# Altium schematic sheet controller module.SchDoc: EE 453 Capstone
size C; ApprovedBy: Your Name; CheckedBy: Your Name; Author: Your Name; CompanyName: Dept. of Elec. and Comp. Engg.; DrawnBy: Your Name; Engineer: Your Nmae; Organization: UW-Seattle; Address1: 185 Stevens Way; Address2: Paul Allen Center; Address3: Seattle, WA; Address4: US-98195; DocumentNumber: 1; Revision: 1.0; SheetNumber: 1; SheetTotal: 1
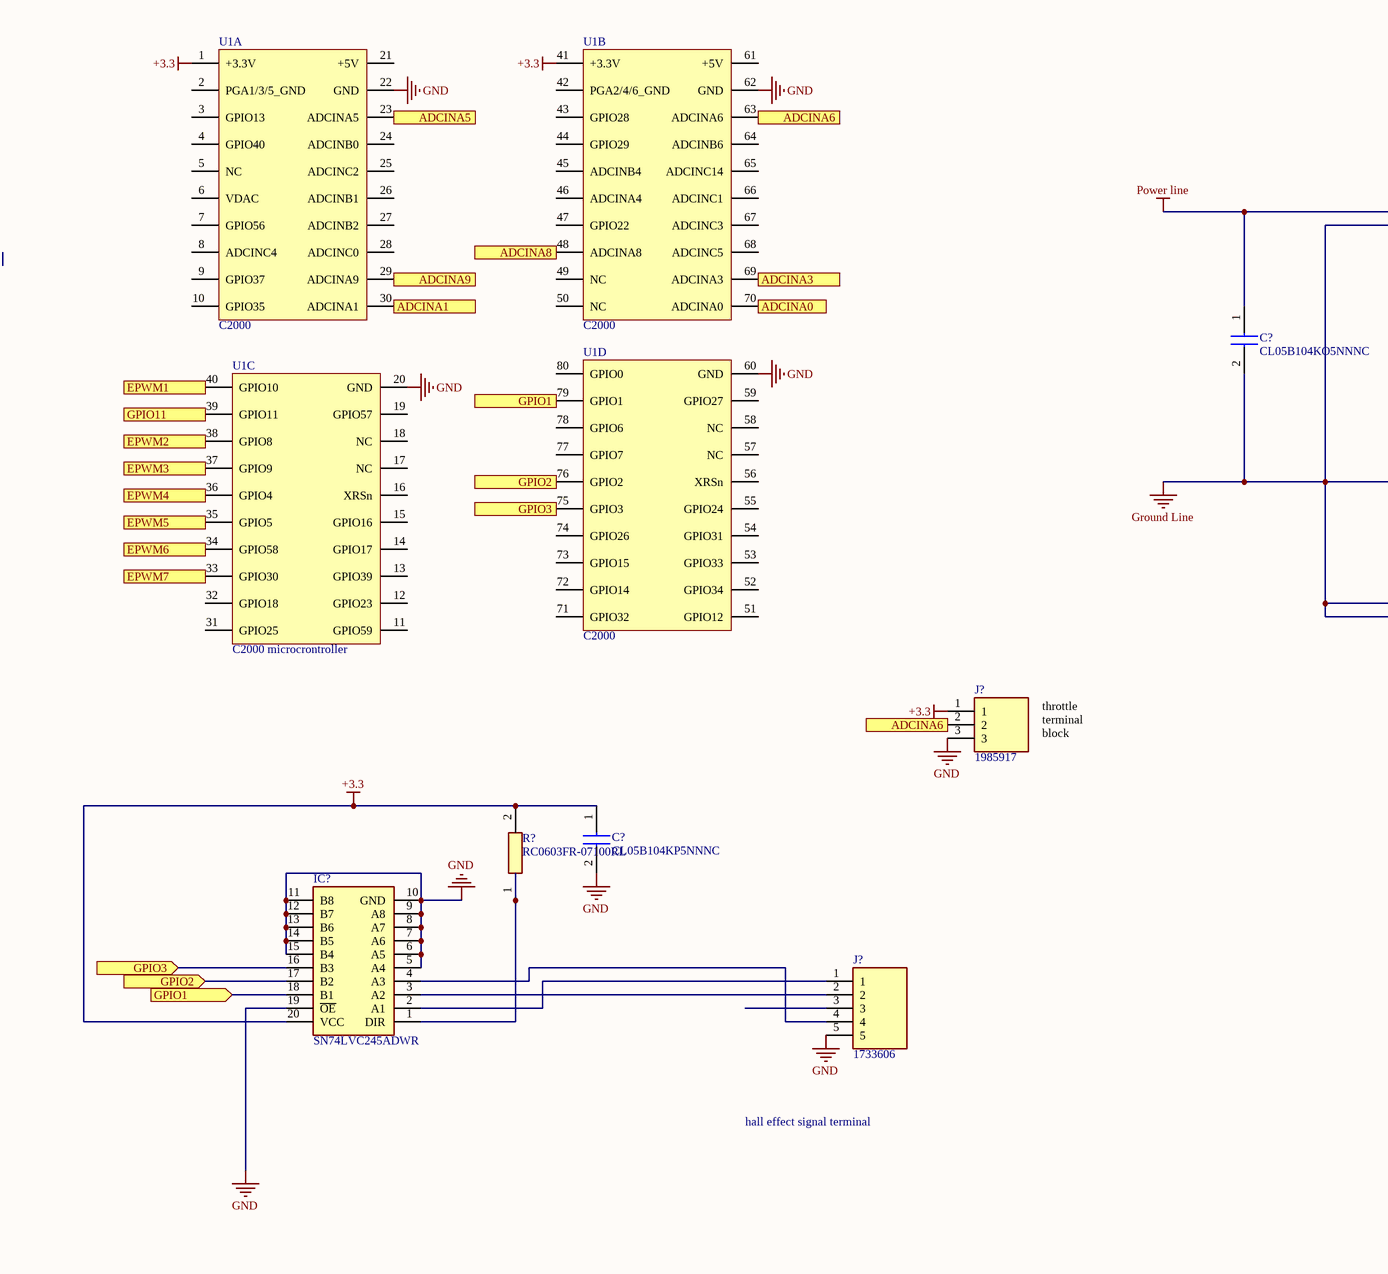
[diagram p0: controller module.SchDoc, left]
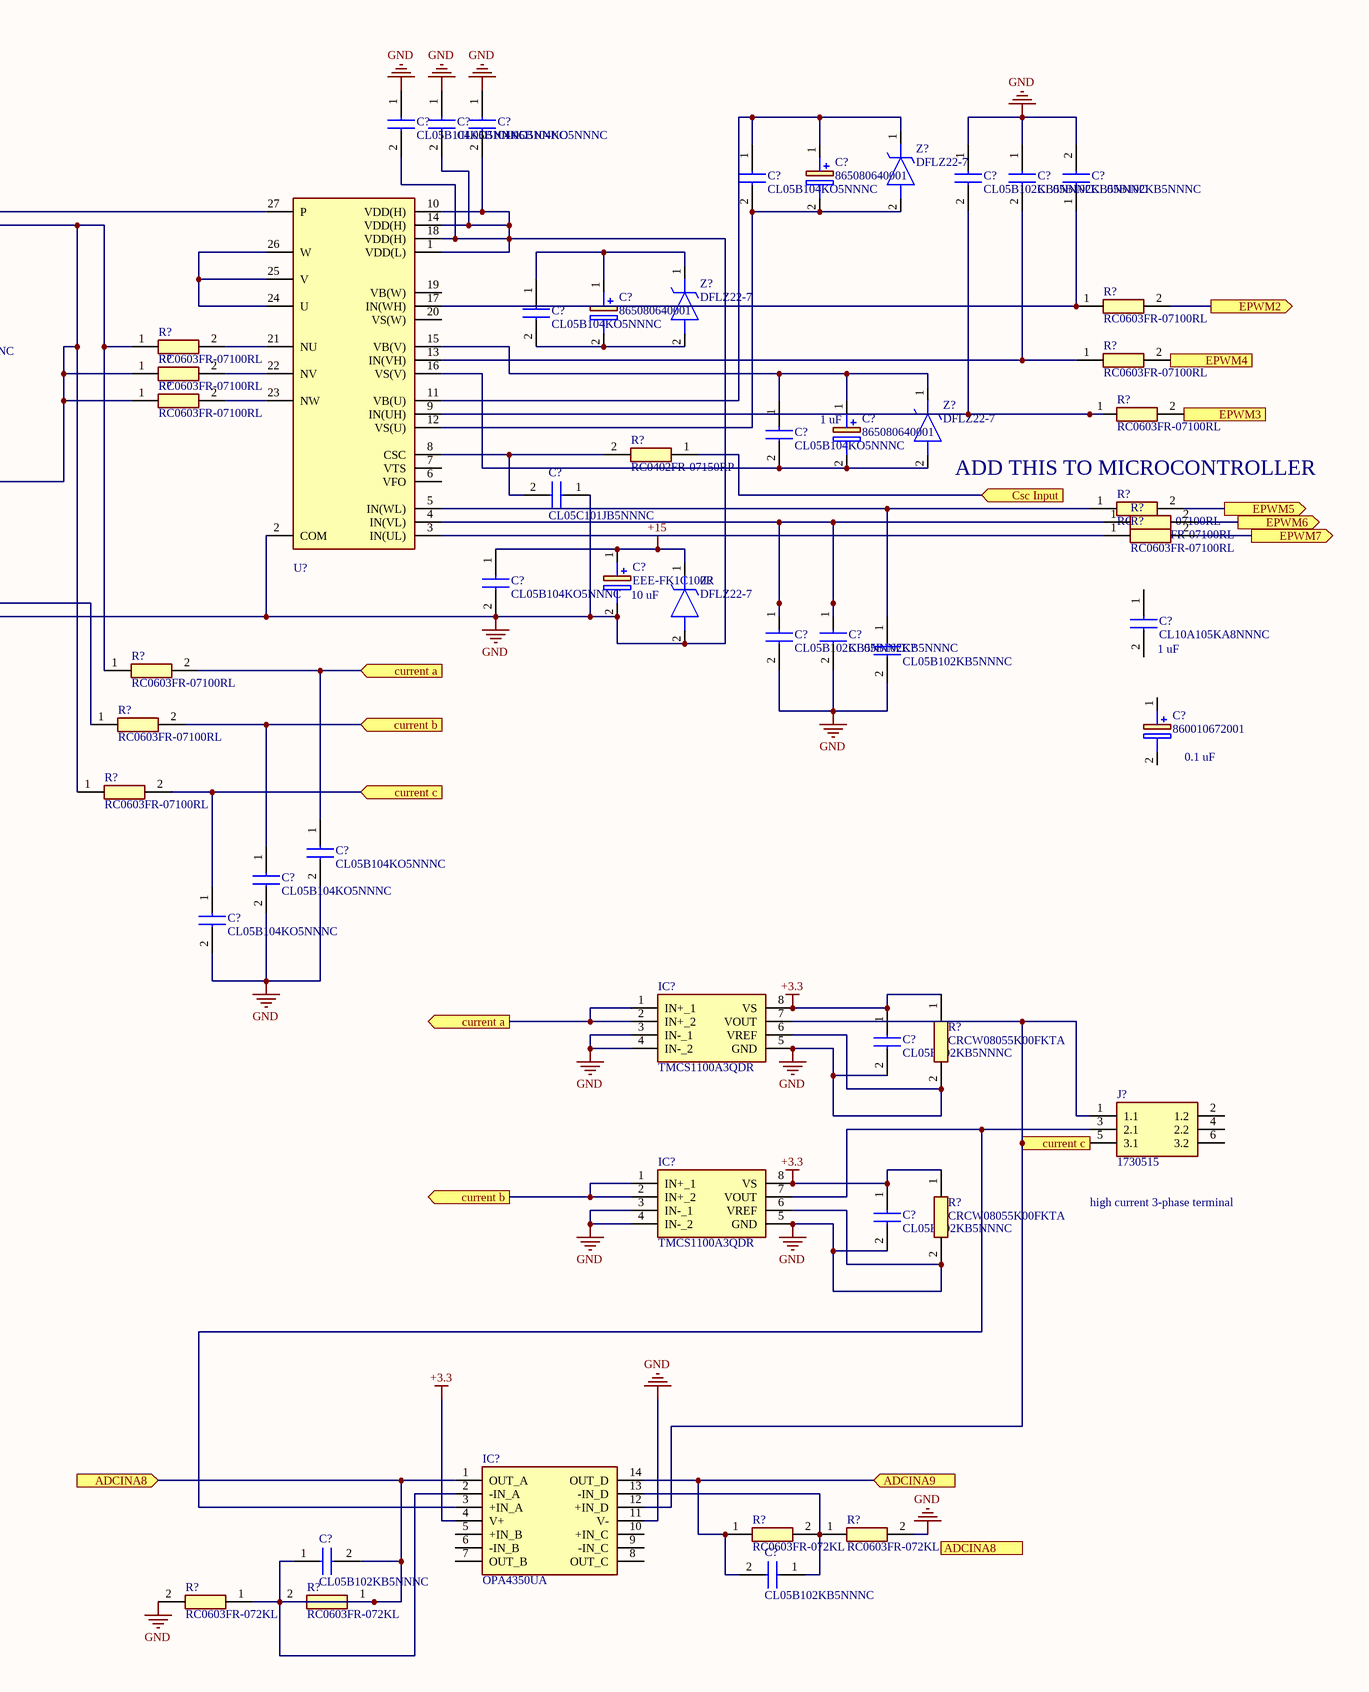
[diagram p1: controller module.SchDoc, right]

## Parts
(Parts that share a designator on the sheet are numbered #1, #2 ... from top to bottom, then left to right.)
C?#1  CL05B104KO5NNNC  [CAPC1005X55N]
C?#2  CL05B104KO5NNNC  [CAPC1005X55N]
C?#3  CL05B104KO5NNNC  [CAPC1005X55N]
C?#4  CL05B104KO5NNNC  [CAPC1005X55N]
C?#5  865080640001  [CAPAE430X550N]
C?#6  CL05B102KB5NNNC  [CAPC1005X55N]
C?#7  CL05B102KB5NNNC  [CAPC1005X55N]
C?#8  CL05B102KB5NNNC  [CAPC1005X55N]
C?#9  CL05B104KO5NNNC  [CAPC1005X55N]
C?#10  865080640001  [CAPAE430X550N]
C?#11  CL05B104KO5NNNC  [CAPC1005X55N]
C?#12  CL05B104KO5NNNC  [CAPC1005X55N]
C?#13  865080640001  [CAPAE430X550N]
C?#14  CL05C101JB5NNNC  [CAPC1005X55N]
C?#15  CL05B104KO5NNNC  [CAPC1005X55N]
C?#16  EEE-FK1C100R  [EEE1AA220WR]
C?#17  CL10A105KA8NNNC  [CAPC1608X90N]
C?#18  CL05B102KB5NNNC  [CAPC1005X55N]
C?#19  CL05B102KB5NNNC  [CAPC1005X55N]
C?#20  CL05B102KB5NNNC  [CAPC1005X55N]
C?#21  860010672001  [CAPPRD200W52D500H1250]
C?#22  CL05B104KP5NNNC  [CAPC1005X55N]
C?#23  CL05B104KO5NNNC  [CAPC1005X55N]
C?#24  CL05B104KO5NNNC  [CAPC1005X55N]
C?#25  CL05B104KO5NNNC  [CAPC1005X55N]
C?#26  CL05B102KB5NNNC  [CAPC1005X55N]
C?#27  CL05B102KB5NNNC  [CAPC1005X55N]
C?#28  CL05B102KB5NNNC  [CAPC1005X55N]
C?#29  CL05B102KB5NNNC  [CAPC1005X55N]
IC?#1  TMCS1100A3QDR  [SOIC127P600X175-8N]
IC?#2  SN74LVC245ADWR  [SOIC127P1030X265-20N]
IC?#3  TMCS1100A3QDR  [SOIC127P600X175-8N]
IC?#4  OPA4350UA  [SOIC127P600X175-14N]
J?#1  1985917  [1985917]
J?#2  1733606  [1733606]
J?#3  1730515  [1730515]
R?#1  RC0603FR-07100RL  [RESC1608X55N]
R?#2  RC0603FR-07100RL  [RESC1608X55N]
R?#3  RC0603FR-07100RL  [RESC1608X55N]
R?#4  RC0603FR-07100RL  [RESC1608X55N]
R?#5  RC0603FR-07100RL  [RESC1608X55N]
R?#6  RC0603FR-07100RL  [RESC1608X55N]
R?#7  RC0402FR-07150RP  [RESC1005X40N]
R?#8  RC0603FR-07100RL  [RESC1608X55N]
R?#9  RC0603FR-07100RL  [RESC1608X55N]
R?#10  RC0603FR-07100RL  [RESC1608X55N]
R?#11  RC0603FR-07100RL  [RESC1608X55N]
R?#12  RC0603FR-07100RL  [RESC1608X55N]
R?#13  RC0603FR-07100RL  [RESC1608X55N]
R?#14  RC0603FR-07100RL  [RESC1608X55N]
R?#15  CRCW08055K00FKTA  [RESC2012X50N]
R?#16  CRCW08055K00FKTA  [RESC2012X50N]
R?#17  RC0603FR-072KL  [RESC1608X55N]
R?#18  RC0603FR-072KL  [RESC1608X55N]
R?#19  RC0603FR-072KL  [RESC1608X55N]
R?#20  RC0603FR-072KL  [RESC1608X55N]
U1  C2000  [C2000]  (parts A,B,C,D of 4)
U?  FNB34060T  [FNB34060T]  (value not drawn)
Z?#1  DFLZ22-7  [POWERDI123_1]
Z?#2  DFLZ22-7  [POWERDI123_1]
Z?#3  DFLZ22-7  [POWERDI123_1]
Z?#4  DFLZ22-7  [POWERDI123_1]

## Ports
ADCINA0 (out), ADCINA1 (out), ADCINA3 (out), ADCINA5 (out), ADCINA6 (out), ADCINA8 (in), ADCINA8 (out), ADCINA9 (in), ADCINA9 (out), Csc Input (in), current a (in), current a (out), current b (in), current b (out), current c (in), current c (out), EPWM1 (in), EPWM2 (in), EPWM2 (out), EPWM3 (in), EPWM3 (out), EPWM4 (in), EPWM4 (out), EPWM5 (in), EPWM5 (out), EPWM6 (in), EPWM6 (out), EPWM7 (in), EPWM7 (out), GPIO1 (in), GPIO1 (out), GPIO2 (in), GPIO2 (out), GPIO3 (in), GPIO3 (out), GPIO11 (in)

## Nets
+3.3: C?#22.1 C?#26.1 C?#27.1 IC?#1.8(VS) IC?#2.20(VCC) IC?#3.8(VS) IC?#4.4(V+) J?#1.1 R?#14.2 R?#15.1 R?#16.1 U1.1(+3.3V) U1.41(+3.3V)
+15: C?#15.1 C?#16.1(+) Z?#4.1(K)
GND: C?#1.1 C?#1.2 C?#2.1 C?#2.2 C?#3.1 C?#3.2 C?#6.1 C?#7.1 C?#8.2 C?#11.2 C?#14.1 C?#15.2 C?#16.2(-) C?#18.2 C?#19.2 C?#20.2 C?#22.2 C?#23.2 C?#24.2 C?#25.2 C?#26.2 C?#27.2 IC?#1.3(IN-_1) IC?#1.4(IN-_2) IC?#1.5(GND) IC?#1.6(VREF) IC?#2.5(A4) IC?#2.6(A5) IC?#2.7(A6) IC?#2.8(A7) IC?#2.9(A8) IC?#2.10(GND) IC?#2.11(B8) IC?#2.12(B7) IC?#2.13(B6) IC?#2.14(B5) IC?#2.15(B4) IC?#2.19(~{OE}) IC?#3.3(IN-_1) IC?#3.4(IN-_2) IC?#3.5(GND) IC?#3.6(VREF) IC?#4.11(V-) J?#1.3 J?#2.5 R?#2.1 R?#4.1 R?#5.1 R?#11.1 R?#12.1 R?#13.1 R?#15.2 R?#16.2 R?#18.2 R?#19.2 U1.20(GND) U1.22(GND) U1.60(GND) U1.62(GND) U?.1(VDD(L)) U?.2(COM) U?.10(VDD(H)) U?.14(VDD(H)) U?.18(VDD(H)) Z?#4.2(A)  [also labelled Ground Line]
Power line: C?#11.1 U?.27(P)
ADCINA0: U1.70(ADCINA0) ; port ADCINA0
ADCINA1: U1.30(ADCINA1) ; port ADCINA1
ADCINA3: U1.69(ADCINA3) ; port ADCINA3
ADCINA5: U1.23(ADCINA5) ; port ADCINA5
ADCINA6: J?#1.2 U1.63(ADCINA6) ; port ADCINA6
ADCINA8: C?#28.1 C?#28.2 IC?#4.1(OUT_A) IC?#4.2(-IN_A) R?#19.1 R?#20.1 R?#20.2 U1.48(ADCINA8) ; port ADCINA8
ADCINA9: C?#29.2 IC?#4.14(OUT_D) R?#17.1 U1.29(ADCINA9) ; port ADCINA9
Csc Input: R?#7.1 ; port Csc Input
current a: C?#23.1 IC?#1.1(IN+_1) IC?#1.2(IN+_2) R?#11.2 ; port current a
current b: C?#24.1 IC?#3.1(IN+_1) IC?#3.2(IN+_2) R?#12.2 ; port current b
current c: C?#25.1 IC?#1.7(VOUT) IC?#4.12(+IN_D) J?#3.1(1.1) J?#3.5(3.1) R?#13.2 ; port current c
EPWM1: U1.40(GPIO10) ; port EPWM1
EPWM2: R?#1.2 U1.38(GPIO8) ; port EPWM2
EPWM3: R?#6.2 U1.37(GPIO9) ; port EPWM3
EPWM4: R?#3.2 U1.36(GPIO4) ; port EPWM4
EPWM5: R?#8.2 U1.35(GPIO5) ; port EPWM5
EPWM6: R?#9.2 U1.34(GPIO58) ; port EPWM6
EPWM7: R?#10.2 U1.33(GPIO30) ; port EPWM7
GPIO1: IC?#2.18(B1) U1.79(GPIO1) ; port GPIO1
GPIO2: IC?#2.17(B2) U1.76(GPIO2) ; port GPIO2
GPIO3: IC?#2.16(B3) U1.75(GPIO3) ; port GPIO3
GPIO11: U1.39(GPIO11) ; port GPIO11
NetC?#4_1: C?#4.1 C?#5.1(+) U?.11(VB(U)) Z?#1.1(K)
NetC?#4_2: C?#4.2 C?#5.2(-) U?.12(VS(U)) Z?#1.2(A)
NetC?#6_2: C?#6.2 R?#6.1 U?.9(IN(UH))
NetC?#7_2: C?#7.2 R?#3.1 U?.13(IN(VH))
NetC?#8_1: C?#8.1 R?#1.1 U?.17(IN(WH))
NetC?#9_1: C?#9.1 C?#10.1(+) Z?#2.1(K)
NetC?#9_2: C?#9.2 C?#10.2(-) Z?#2.2(A)
NetC?#12_1: C?#12.1 C?#13.1(+) U?.15(VB(V)) Z?#3.1(K)
NetC?#12_2: C?#12.2 C?#13.2(-) U?.16(VS(V)) Z?#3.2(A)
NetC?#14_2: C?#14.2 R?#7.2 U?.8(CSC)
NetC?#18_1: C?#18.1 C?#19.1 R?#9.1 U?.4(IN(VL))
NetC?#20_1: C?#20.1 R?#8.1 U?.5(IN(WL))
NetC?#29_1: C?#29.1 IC?#4.13(-IN_D) R?#17.2 R?#18.1
NetIC?#2_1: IC?#2.1(DIR) R?#14.1
NetIC?#2_2: IC?#2.2(A1) J?#2.1
NetIC?#2_3: IC?#2.3(A2) J?#2.2
NetIC?#2_4: IC?#2.4(A3) J?#2.4
NetIC?#3_7: IC?#3.7(VOUT) IC?#4.3(+IN_A) J?#3.3(2.1)
NetR?#2_2: R?#2.2 U?.21(NU)
NetR?#4_2: R?#4.2 U?.22(NV)
NetR?#5_2: R?#5.2 U?.23(NW)
NetR?#10_1: R?#10.1 U?.3(IN(UL))
NetU?_24: U?.24(U) U?.25(V) U?.26(W)

Not connected (* = marked no-connect by the designer): C?#17 1 2; C?#21 1(+) 2(-); IC?#4 5(+IN_B) 6(-IN_B) 7(OUT_B) 8(OUT_C) 9(-IN_C) 10(+IN_C); J?#2 3; J?#3 2(1.2) 4(2.2) 6(3.2); U1 2(PGA1/3/5_GND) 3(GPIO13) 4(GPIO40) 5(NC) 6(VDAC) 7(GPIO56) 8(ADCINC4) 9(GPIO37) 10(GPIO35) 11(GPIO59) 12(GPIO23) 13(GPIO39) 14(GPIO17) 15(GPIO16) 16(XRSn) 17(NC) 18(NC) 19(GPIO57) 21(+5V) 24(ADCINB0) 25(ADCINC2) 26(ADCINB1) 27(ADCINB2) 28(ADCINC0) 31(GPIO25) 32(GPIO18) 42(PGA2/4/6_GND) 43(GPIO28) 44(GPIO29) 45(ADCINB4) 46(ADCINA4) 47(GPIO22) 49(NC) 50(NC) 51(GPIO12) 52(GPIO34) 53(GPIO33) 54(GPIO31) 55(GPIO24) 56(XRSn) 57(NC) 58(NC) 59(GPIO27) 61(+5V) 64(ADCINB6) 65(ADCINC14) 66(ADCINC1) 67(ADCINC3) 68(ADCINC5) 71(GPIO32) 72(GPIO14) 73(GPIO15) 74(GPIO26) 77(GPIO7) 78(GPIO6) 80(GPIO0); U? 6(VFO) 7(VTS) 19(VB(W)) 20(VS(W))

## Notes on the sheet
- (near C?#13) 1 uF
- ADD THIS TO MICROCONTROLLER
- 10 uF
- (near C?#17) 1 uF
- throttle terminal block
- (near C?#21) 0.1 uF
- (near IC?#1) Text
- hall effect signal terminal
- (near IC?#3) Text
- high current 3-phase terminal
- Title
- Size:
- Date:
- File:
- C
- Number:
- Time:
- Revision:
- Sheet
- of

## Library data of the parts
C?#1-C?#4 C?#9 C?#11 C?#12 C?#15 C?#23-C?#25 = CL05B104KO5NNNC: Capacitor; Manufacturer_Name: Samsung Electro-Mechanics; Datasheet Link: https://datasheet.datasheetarchive.com/originals/distributors/Datasheets-DGA10/2408147.pdf; Height: 0.55mm; Manufacturer_Part_Number: CL05B104KO5NNNC; Mouser Part Number: 187-CL05B104KO5NNNC; Mouser Price/Stock: https://www.mouser.co.uk/ProductDetail/Samsung-Electro-Mechanics/CL05B104KO5NNNC?qs=hqM3L16%252BxlfT2SKOuAUq6Q%3D%3D; Arrow Part Number: CL05B104KO5NNNC; Arrow Price/Stock: https://www.arrow.com/en/products/cl05b104ko5nnnc/samsung-electro-mechanics?region=europe
C?#5 C?#10 C?#13 = 865080640001: Capacitor Polarised; Manufacturer_Name: Wurth Elektronik; Datasheet Link: https://www.we-online.com/catalog/datasheet/865080640001.pdf; Height: 5.5mm; Manufacturer_Part_Number: 865080640001; Mouser Part Number: 710-865080640001; Mouser Price/Stock: https://www.mouser.co.uk/ProductDetail/Wurth-Elektronik/865080640001?qs=0KOYDY2FL28T3O9R7owGdg%3D%3D
C?#6-C?#8 C?#18-C?#20 C?#26-C?#29 = CL05B102KB5NNNC: Capacitor; Manufacturer_Name: Samsung Electro-Mechanics; Datasheet Link: https://datasheet.datasheetarchive.com/originals/distributors/Datasheets-DGA10/2407970.pdf; Height: 0.55mm; Manufacturer_Part_Number: CL05B102KB5NNNC; Mouser Part Number: 187-CL05B102KB5NNNC; Mouser Price/Stock: https://www.mouser.co.uk/ProductDetail/Samsung-Electro-Mechanics/CL05B102KB5NNNC?qs=349EhDEZ59ruHuges06d1Q%3D%3D; Arrow Part Number: CL05B102KB5NNNC; Arrow Price/Stock: https://www.arrow.com/en/products/cl05b102kb5nnnc/samsung-electro-mechanics
C?#14 = CL05C101JB5NNNC: Capacitor; Manufacturer_Name: Samsung Electro-Mechanics; Datasheet Link: https://4donline.ihs.com/images/VipMasterIC/IC/SEMS/SEMS-S-A0008529205/SEMS-S-A0008529205-1.pdf?hkey=EF798316E3902B6ED9A73243A3159BB0; Height: 0.55mm; Manufacturer_Part_Number: CL05C101JB5NNNC; Mouser Part Number: 187-CL05C101JB5NNNC; Mouser Price/Stock: https://www.mouser.co.uk/ProductDetail/Samsung-Electro-Mechanics/CL05C101JB5NNNC?qs=349EhDEZ59paexK6JjA00Q%3D%3D; Arrow Part Number: CL05C101JB5NNNC; Arrow Price/Stock: https://www.arrow.com/en/products/cl05c101jb5nnnc/samsung-electro-mechanics?region=europe
C?#16 = EEE-FK1C100R: Capacitor Polarised; Manufacturer_Name: Panasonic; Datasheet Link: http://industrial.panasonic.com/cdbs/www-data/pdf/RDE0000/ABA0000C1181.pdf; Height: 5.5mm; Manufacturer_Part_Number: EEE-FK1C100R; Mouser Part Number: 667-EEE-FK1C100R; Mouser Price/Stock: https://www.mouser.co.uk/ProductDetail/Panasonic/EEE-FK1C100R/?qs=qE6bgDGEOCvwL%2FHBRL1emg%3D%3D; Arrow Part Number: EEE-FK1C100R; Arrow Price/Stock: https://www.arrow.com/en/products/eee-fk1c100r/panasonic
C?#17 = CL10A105KA8NNNC: Capacitor; Manufacturer_Name: Samsung Electro-Mechanics; Datasheet Link: http://uk.rs-online.com/web/p/products/7664838; Height: 0.9mm; Manufacturer_Part_Number: CL10A105KA8NNNC; Mouser Part Number: 187-CL10A105KA8NNNC; Mouser Price/Stock: https://www.mouser.co.uk/ProductDetail/Samsung-Electro-Mechanics/CL10A105KA8NNNC?qs=hqM3L16%252BxldY%252BnK4KzDJVg%3D%3D; Arrow Part Number: CL10A105KA8NNNC; Arrow Price/Stock: https://www.arrow.com/en/products/cl10a105ka8nnnc/samsung-electro-mechanics?region=europe
C?#21 = 860010672001: Capacitor Polarised; Manufacturer_Name: Wurth Elektronik; Datasheet Link: http://katalog.we-online.com/pbs/datasheet/860010672001.pdf; Height: 12.5mm; Manufacturer_Part_Number: 860010672001; Mouser Part Number: 710-860010672001; Mouser Price/Stock: https://www.mouser.co.uk/ProductDetail/Wurth-Elektronik/860010672001?qs=0KOYDY2FL2%252BAjnDJgnKoow%3D%3D
C?#22 = CL05B104KP5NNNC: Capacitor; Manufacturer_Name: Samsung Electro-Mechanics; Datasheet Link: http://product.samsungsem.com/mlcc/CL05B104KP5NNN.do; Height: 0.55mm; Manufacturer_Part_Number: CL05B104KP5NNNC; Arrow Part Number: CL05B104KP5NNNC; Arrow Price/Stock: https://www.arrow.com/en/products/cl05b104kp5nnnc/samsung-electro-mechanics
IC?#1 IC?#3 = TMCS1100A3QDR: Integrated Circuit; Manufacturer_Name: Texas Instruments; Datasheet Link: https://www.ti.com/lit/ds/symlink/tmcs1100.pdf?ts=1594860806844&ref_url=https%253A%252F%252Fwww.google.com%252F; Height: 1.75mm; Manufacturer_Part_Number: TMCS1100A3QDR; Mouser Part Number: 595-TMCS1100A3QDR; Mouser Price/Stock: https://www.mouser.co.uk/ProductDetail/Texas-Instruments/TMCS1100A3QDR?qs=sPbYRqrBIVlRk9SPKVRa%2Fw%3D%3D; Arrow Part Number: TMCS1100A3QDR; Arrow Price/Stock: https://www.arrow.com/en/products/tmcs1100a3qdr/texas-instruments
IC?#2 = SN74LVC245ADWR: Integrated Circuit; Manufacturer_Name: Texas Instruments; Datasheet Link: http://www.ti.com/general/docs/suppproductinfo.tsp?distId=10&gotoUrl=http%3A%2F%2Fwww.ti.com%2Flit%2Fgpn%2Fsn74lvc245a; Height: 2.65mm; Manufacturer_Part_Number: SN74LVC245ADWR; Mouser Part Number: 595-SN74LVC245ADWR; Mouser Price/Stock: https://www.mouser.co.uk/ProductDetail/Texas-Instruments/SN74LVC245ADWR?qs=WzgTT80quPGdOFCXqni3uA%3D%3D; Arrow Part Number: SN74LVC245ADWR; Arrow Price/Stock: https://www.arrow.com/en/products/sn74lvc245adwr/texas-instruments?region=nac
IC?#4 = OPA4350UA: Integrated Circuit; Manufacturer_Name: Texas Instruments; Datasheet Link: http://www.ti.com/lit/ds/symlink/opa4350.pdf; Height: 1.75mm; Manufacturer_Part_Number: OPA4350UA; Mouser Part Number: 595-OPA4350UA; Mouser Price/Stock: https://www.mouser.co.uk/ProductDetail/Texas-Instruments/OPA4350UA?qs=wgAEGBTxy7nj5IqTHE9kog%3D%3D; Arrow Part Number: OPA4350UA; Arrow Price/Stock: https://www.arrow.com/en/products/opa4350ua/texas-instruments?region=nac
J?#1 = 1985917: Connector; Manufacturer_Name: Phoenix Contact; Datasheet Link: https://media.digikey.com/pdf/Data%20Sheets/Phoenix%20Contact%20PDFs/Multi-Postion%20PCTerminal%20Blocks.pdf; Height: 13.95mm; Manufacturer_Part_Number: 1985917; Mouser Part Number: 651-1985917; Mouser Price/Stock: https://www.mouser.co.uk/ProductDetail/Phoenix-Contact/1985917?qs=ibOxrZ%2Fd8eDdpJplVMXgvQ%3D%3D; Arrow Part Number: 1985917; Arrow Price/Stock: https://www.arrow.com/en/products/1985917/phoenix-contact
J?#2 = 1733606: Connector; Manufacturer_Name: Phoenix Contact; Datasheet Link: http://www.phoenixcontact.com/de/produkte/1733606/pdf; Height: 15.45mm; Manufacturer_Part_Number: 1733606; Mouser Part Number: 651-1733606; Mouser Price/Stock: https://www.mouser.co.uk/ProductDetail/Phoenix-Contact/1733606?qs=coeDwHeOZKnxpzvXWWKBZQ%3D%3D; Arrow Part Number: 1733606; Arrow Price/Stock: https://www.arrow.com/en/products/1733606/phoenix-contact
J?#3 = 1730515: Connector; Manufacturer_Name: Phoenix Contact; Datasheet Link: http://www.phoenixcontact.com/de/produkte/1730515/pdf; Height: 18.2mm; Manufacturer_Part_Number: 1730515; Mouser Part Number: 651-1730515; Mouser Price/Stock: https://www.mouser.co.uk/ProductDetail/Phoenix-Contact/1730515?qs=TrDcmYSSX9XUXSghjH3QdQ%3D%3D; Arrow Part Number: 1730515; Arrow Price/Stock: https://www.arrow.com/en/products/1730515/phoenix-contact
R?#1-R?#6 R?#8-R?#14 = RC0603FR-07100RL: Resistor; Manufacturer_Name: YAGEO (PHYCOMP); Datasheet Link: https://datasheet.datasheetarchive.com/originals/distributors/Datasheets_SAMA/902f9e387b938f871d31120f5fc1d65e.pdf; Height: 0.55mm; Manufacturer_Part_Number: RC0603FR-07100RL; Mouser Part Number: 603-RC0603FR-07100RL; Mouser Price/Stock: https://www.mouser.co.uk/ProductDetail/YAGEO/RC0603FR-07100RL?qs=NEN%2FsE%2FLsvPIwIWKCOS4%2FA%3D%3D; Arrow Part Number: RC0603FR-07100RL; Arrow Price/Stock: https://www.arrow.com/en/products/rc0603fr-07100rl/yageo?region=europe
R?#7 = RC0402FR-07150RP: Resistor; Manufacturer_Name: YAGEO (PHYCOMP); Datasheet Link: https://www.arrow.com/en/products/rc0402fr-07150rp/yageo; Height: 0.4mm; Manufacturer_Part_Number: RC0402FR-07150RP; Arrow Part Number: RC0402FR-07150RP; Arrow Price/Stock: https://www.arrow.com/en/products/rc0402fr-07150rp/yageo
R?#15 R?#16 = CRCW08055K00FKTA: Resistor; Manufacturer_Name: Vishay; Datasheet Link: http://www.vishay.com/docs/20035/dcrcwe3.pdf; Height: 0.5mm; Manufacturer_Part_Number: CRCW08055K00FKTA; Mouser Part Number: 71-CRCW0805-5K; Mouser Price/Stock: https://www.mouser.co.uk/ProductDetail/Vishay-Dale/CRCW08055K00FKTA?qs=O7pb%252BE5gJ7THvgJkhh%2F2MQ%3D%3D; Arrow Part Number: CRCW08055K00FKTA; Arrow Price/Stock: https://www.arrow.com/en/products/crcw08055k00fkta/vishay?region=nac
R?#17-R?#20 = RC0603FR-072KL: Resistor; Manufacturer_Name: KEMET; Datasheet Link: https://datasheet.datasheetarchive.com/originals/distributors/Datasheets_SAMA/902f9e387b938f871d31120f5fc1d65e.pdf; Height: 0.55mm; Manufacturer_Part_Number: RC0603FR-072KL; Mouser Part Number: 603-RC0603FR-072KL; Mouser Price/Stock: https://www.mouser.co.uk/ProductDetail/YAGEO/RC0603FR-072KL?qs=diQw95jMAePdEfSTIJQNsQ%3D%3D; Arrow Part Number: RC0603FR-072KL; Arrow Price/Stock: https://www.arrow.com/en/products/rc0603fr-072kl/yageo?region=nac
U1 = C2000: F280049C; Parameter 1: test 2
Z?#1-Z?#4 = DFLZ22-7: Zener Diode; Manufacturer_Name: Diodes Inc.; Datasheet Link: https://www.diodes.com/assets/Datasheets/ds30464.pdf; Manufacturer_Part_Number: DFLZ22-7; Mouser Part Number: 621-DFLZ22-7; Mouser Price/Stock: https://www.mouser.co.uk/ProductDetail/Diodes-Incorporated/DFLZ22-7?qs=mQbszxtPdlOKSswUoR1BqQ%3D%3D; Arrow Part Number: DFLZ22-7; Arrow Price/Stock: https://www.arrow.com/en/products/dflz22-7/diodes-incorporated